# EAGLE design game_board_V2 (EAGLE 9.5.1)
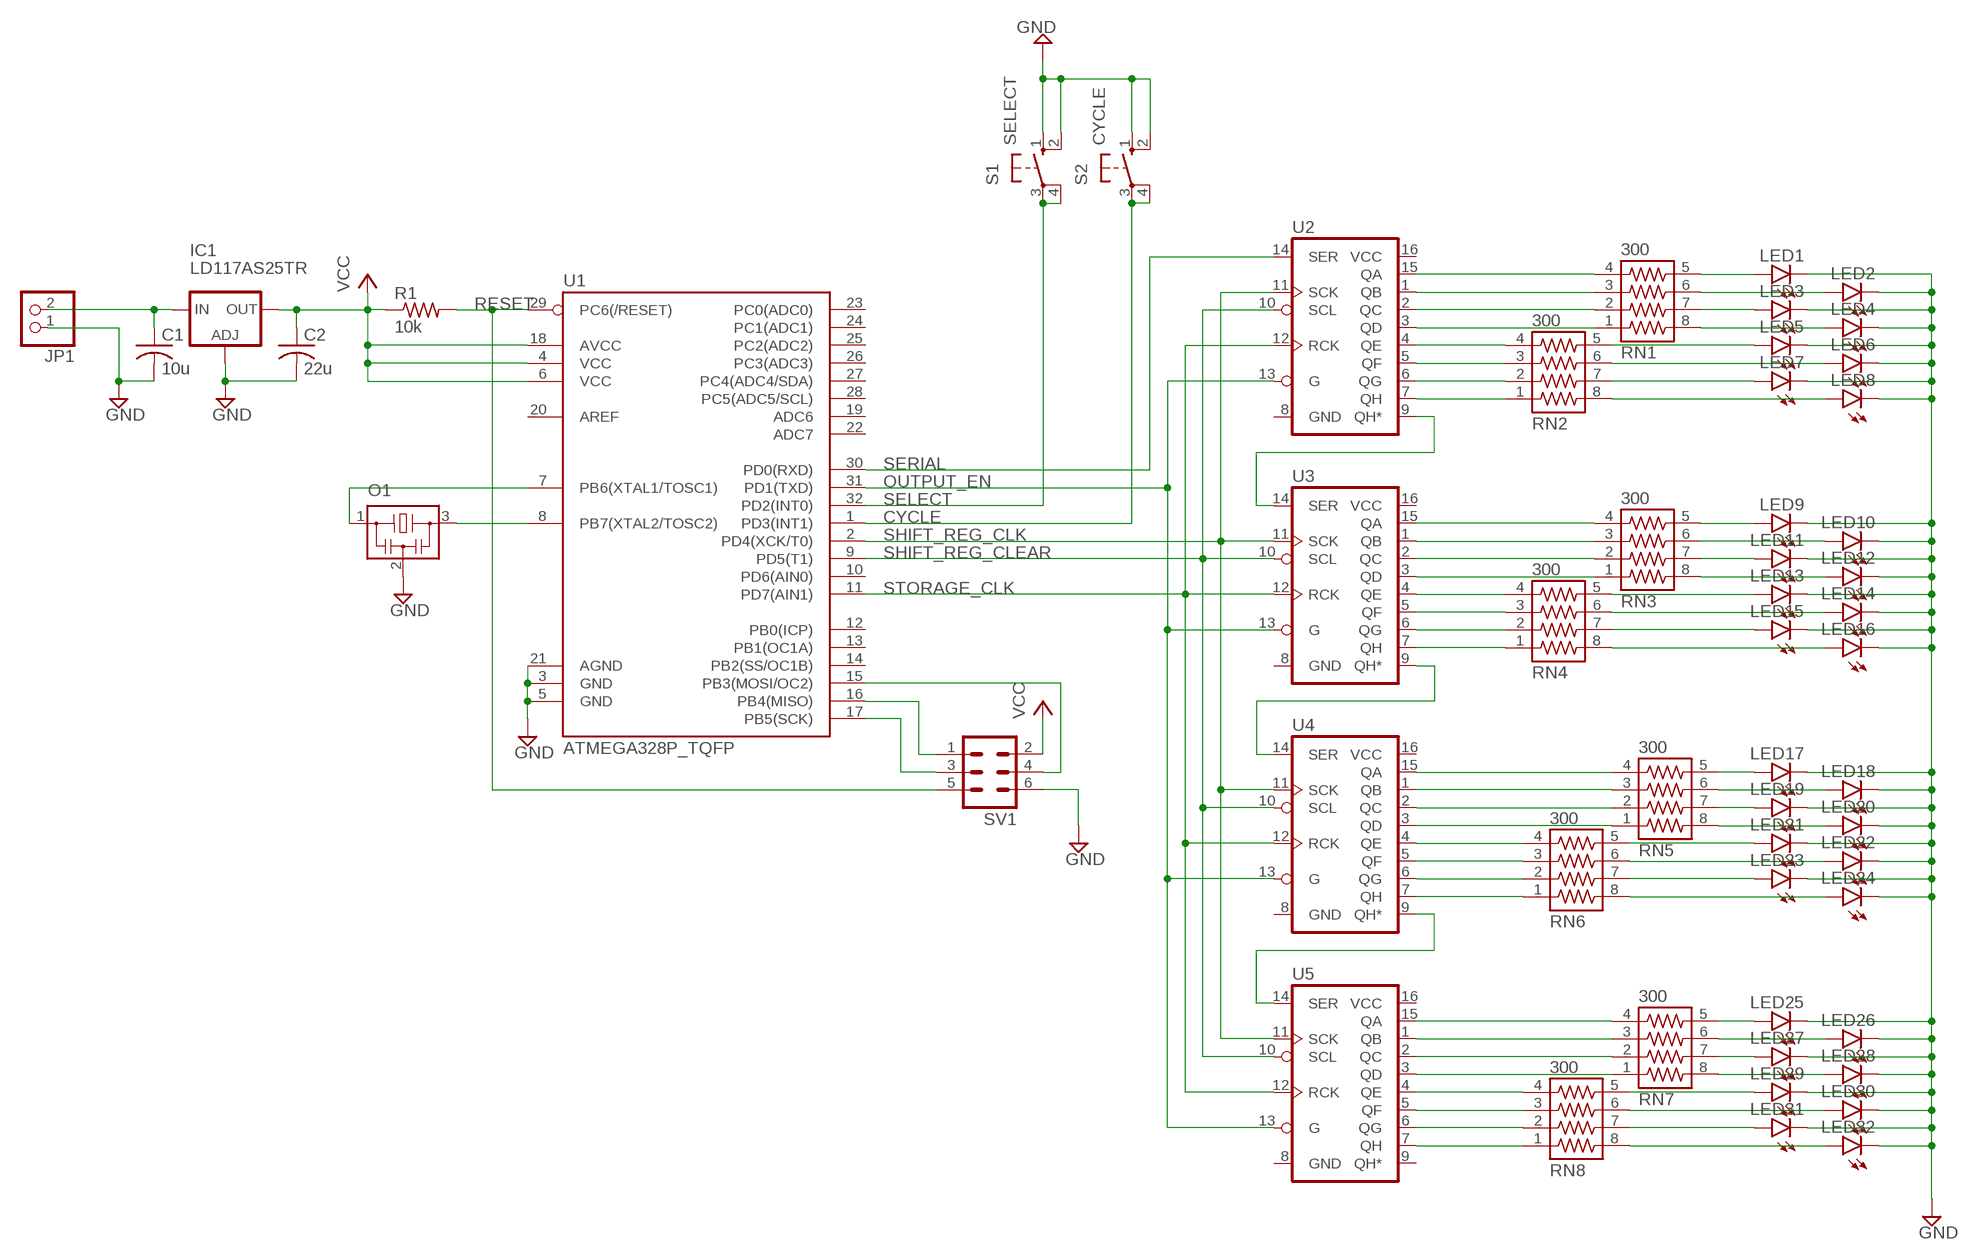
[diagram p0: schematic, sheet 1]

## Parts
C1  10u  C-USC1206K  [C1206K]
C2  22u  C-USC0805K  [C0805K]
IC1  LD117AS25TR  [SOT223]
JP1  PINHD-1X2  [1X02]
LED1  LEDSML0805  [SML0805]
LED2  LEDSML0805  [SML0805]
LED3  LEDSML0805  [SML0805]
LED4  LEDSML0805  [SML0805]
LED5  LEDSML0805  [SML0805]
LED6  LEDSML0805  [SML0805]
LED7  LEDSML0805  [SML0805]
LED8  LEDSML0805  [SML0805]
LED9  LEDSML0805  [SML0805]
LED10  LEDSML0805  [SML0805]
LED11  LEDSML0805  [SML0805]
LED12  LEDSML0805  [SML0805]
LED13  LEDSML0805  [SML0805]
LED14  LEDSML0805  [SML0805]
LED15  LEDSML0805  [SML0805]
LED16  LEDSML0805  [SML0805]
LED17  LEDSML0805  [SML0805]
LED18  LEDSML0805  [SML0805]
LED19  LEDSML0805  [SML0805]
LED20  LEDSML0805  [SML0805]
LED21  LEDSML0805  [SML0805]
LED22  LEDSML0805  [SML0805]
LED23  LEDSML0805  [SML0805]
LED24  LEDSML0805  [SML0805]
LED25  LEDSML0805  [SML0805]
LED26  LEDSML0805  [SML0805]
LED27  LEDSML0805  [SML0805]
LED28  LEDSML0805  [SML0805]
LED29  LEDSML0805  [SML0805]
LED30  LEDSML0805  [SML0805]
LED31  LEDSML0805  [SML0805]
LED32  LEDSML0805  [SML0805]
O1  CSTNE16M0V530000R0  [CSTCR6M]
R1  10k  R-US_R0603  [R0603]
RN1  300  1206_4RES_ARRAY1206  [RESCAXS80P320X250X60-8]
RN2  300  1206_4RES_ARRAY1206  [RESCAXS80P320X250X60-8]
RN3  300  1206_4RES_ARRAY1206  [RESCAXS80P320X250X60-8]
RN4  300  1206_4RES_ARRAY1206  [RESCAXS80P320X250X60-8]
RN5  300  1206_4RES_ARRAY1206  [RESCAXS80P320X250X60-8]
RN6  300  1206_4RES_ARRAY1206  [RESCAXS80P320X250X60-8]
RN7  300  1206_4RES_ARRAY1206  [RESCAXS80P320X250X60-8]
RN8  300  1206_4RES_ARRAY1206  [RESCAXS80P320X250X60-8]
S1  SELECT  10-XX  [B3F-10XX]
S2  CYCLE  10-XX  [B3F-10XX]
SV1  MA03-2  [MA03-2]
U1  ATMEGA328P_TQFP  [TQFP32-08]
U2  74595  [TSSOP16]
U3  74595  [TSSOP16]
U4  74595  [TSSOP16]
U5  74595  [TSSOP16]

## Nets
CARRY1: U2.9(QH*) U3.14(SER)
CARRY2: U3.9(QH*) U4.14(SER)
CARRY3: U4.9(QH*) U5.14(SER)
CYCLE: S2.3(P) S2.4(P1) U1.1(PD3(INT1))
GND: C1.2 C2.2 IC1.1(ADJ) JP1.1 LED1.C LED2.C LED3.C LED4.C LED5.C LED6.C LED7.C LED8.C LED9.C LED10.C LED11.C LED12.C LED13.C LED14.C LED15.C LED16.C LED17.C LED18.C LED19.C LED20.C LED21.C LED22.C LED23.C LED24.C LED25.C LED26.C LED27.C LED28.C LED29.C LED30.C LED31.C LED32.C O1.2 S1.1(S) S1.2(S1) S2.1(S) S2.2(S1) SV1.6 U1.3(GND) U1.5(GND) U1.21(AGND)
MISO: SV1.1 U1.16(PB4(MISO))
MOSI: SV1.4 U1.15(PB3(MOSI/OC2))
N$1: O1.1 U1.7(PB6(XTAL1/TOSC1))
N$2: O1.3 U1.8(PB7(XTAL2/TOSC2))
N$3: RN2.1 U2.7(QH)
N$4: RN2.2 U2.6(QG)
N$5: RN2.3 U2.5(QF)
N$6: RN2.4 U2.4(QE)
N$10: RN1.1 U2.3(QD)
N$11: RN1.2 U2.2(QC)
N$12: RN1.3 U2.1(QB)
N$13: RN1.4 U2.15(QA)
N$14: LED1.A RN1.5
N$15: LED2.A RN1.6
N$16: LED3.A RN1.7
N$17: LED4.A RN1.8
N$18: LED5.A RN2.5
N$19: LED6.A RN2.6
N$20: LED7.A RN2.7
N$21: LED8.A RN2.8
N$22: RN5.4 U4.15(QA)
N$23: RN5.3 U4.1(QB)
N$24: RN5.2 U4.2(QC)
N$25: RN5.1 U4.3(QD)
N$26: RN6.4 U4.4(QE)
N$27: RN6.3 U4.5(QF)
N$28: RN6.2 U4.6(QG)
N$29: RN6.1 U4.7(QH)
N$30: LED24.A RN6.8
N$31: LED23.A RN6.7
N$32: LED22.A RN6.6
N$33: LED21.A RN6.5
N$34: LED20.A RN5.8
N$35: LED19.A RN5.7
N$36: LED18.A RN5.6
N$37: LED17.A RN5.5
N$38: RN4.1 U3.7(QH)
N$39: RN4.2 U3.6(QG)
N$40: RN4.3 U3.5(QF)
N$41: RN4.4 U3.4(QE)
N$42: RN3.1 U3.3(QD)
N$43: RN3.2 U3.2(QC)
N$44: RN3.3 U3.1(QB)
N$45: RN3.4 U3.15(QA)
N$46: LED13.A RN4.5
N$47: LED14.A RN4.6
N$48: LED15.A RN4.7
N$49: LED16.A RN4.8
N$50: LED12.A RN3.8
N$51: LED11.A RN3.7
N$52: LED10.A RN3.6
N$53: LED9.A RN3.5
N$54: RN7.4 U5.15(QA)
N$55: RN7.3 U5.1(QB)
N$56: RN7.2 U5.2(QC)
N$57: RN7.1 U5.3(QD)
N$58: RN8.4 U5.4(QE)
N$59: RN8.3 U5.5(QF)
N$60: RN8.2 U5.6(QG)
N$61: RN8.1 U5.7(QH)
N$62: LED32.A RN8.8
N$63: LED31.A RN8.7
N$64: LED30.A RN8.6
N$65: LED29.A RN8.5
N$66: LED28.A RN7.8
N$67: LED27.A RN7.7
N$68: LED26.A RN7.6
N$69: LED25.A RN7.5
OUTPUT_EN: U1.31(PD1(TXD)) U2.13(G) U3.13(G) U4.13(G) U5.13(G)
RESET: R1.2 SV1.5 U1.29(PC6(/RESET))
SCK: SV1.3 U1.17(PB5(SCK))
SELECT: S1.3(P) S1.4(P1) U1.32(PD2(INT0))
SERIAL: U1.30(PD0(RXD)) U2.14(SER)
SHIFT_REG_CLEAR: U1.9(PD5(T1)) U2.10(SCL) U3.10(SCL) U4.10(SCL) U5.10(SCL)
SHIFT_REG_CLK: U1.2(PD4(XCK/T0)) U2.11(SCK) U3.11(SCK) U4.11(SCK) U5.11(SCK)
STORAGE_CLK: U1.11(PD7(AIN1)) U2.12(RCK) U3.12(RCK) U4.12(RCK) U5.12(RCK)
V_IN: C1.1 IC1.3(IN) JP1.2
VCC: C2.1 IC1.4(OUT) R1.1 SV1.2 U1.4(VCC) U1.6(VCC) U1.18(AVCC)
Unconnected: U1.10(PD6(AIN0)) U1.12(PB0(ICP)) U1.13(PB1(OC1A)) U1.14(PB2(SS/OC1B)) U1.19(ADC6) U1.20(AREF) U1.22(ADC7) U1.23(PC0(ADC0)) U1.24(PC1(ADC1)) U1.25(PC2(ADC2)) U1.26(PC3(ADC3)) U1.27(PC4(ADC4/SDA)) U1.28(PC5(ADC5/SCL)) U5.9(QH*)

## Power pins joined to a net without a drawn wire
GND: U2.8(GND) U3.8(GND) U4.8(GND) U5.8(GND)
VCC: U2.16(VCC) U3.16(VCC) U4.16(VCC) U5.16(VCC)

## Library data of the parts
C1 C2 = rcl:C-US: CAPACITOR, American symbol; SPICEPREFIX: C
IC1 = v-reg:LD117A?*: Low drop fixed and adjustable positive voltage regulators 1 A Source: http://www.st.com/stonline/products/literature/ds/7194/ld1117axx.pdf
JP1 = pinhead:PINHD-1X2: PIN HEADER
LED1-LED32 = led:LED: LED OSRAM: - CHIPLED LG R971, LG N971, LY N971, LG Q971, LY Q971, LO R971, LY R971 LH N974, LH R974 LS Q976, LO Q976, LY Q976 LO Q996 - Hyper CHIPLED LW Q18S LB Q993, LB Q99A, LB R99A - SideLED LS A670, LO A670, LY A670, LG A670, LP A670 LB A673, LV A673, LT A673, LW A673 LH A674 LY A675 LS A676, LA A676, LO A676, LY A676, LW A676 LS A679, LY A679, LG A679 - Hyper Micro SIDELED® LS Y876, LA Y876, LO Y876, LY Y876 LT Y87S - SmartLED LW L88C, LW L88S LB L89C, LB L89S, LG L890 LS L89K, LO L89K, LY L89K LS L896, LA L896, LO L896, LY L896 - TOPLED LS T670, LO T670, LY T670, LG T670, LP T670 LSG T670, LSP T670, LSY T670, LOP T670, LYG T670 LG T671, LOG T671, LSG T671 LB T673, LV T673, LT T673, LW T673 LH T674 LS T676, LA T676, LO T676, LY T676, LB T676, LH T676, LSB T676, LW T676 LB T67C, LV T67C, LT T67C, LS T67K, LO T67K, LY T67K, LW E67C LS E67B, LA E67B, LO E67B, LY E67B, LB E67C, LV E67C, LT E67C LW T67C LS T679, LY T679, LG T679 LS T770, LO T770, LY T770, LG T770, LP T770 LB T773, LV T773, LT T773, LW T773 LH T774 LS E675, LA E675, LY E675, LS T675 LS T776, LA T776, LO T776, LY T776, LB T776 LHGB T686 LT T68C, LB T68C - Hyper Mini TOPLED® LB M676 - Mini TOPLED Santana® LG M470 LS M47K, LO M47K, LY M47K Source: http://www.osram.convergy.de LUXEON: - LUMILED® LXK2-PW12-R00, LXK2-PW12-S00, LXK2-PW14-U00, LXK2-PW14-V00 LXK2-PM12-R00, LXK2-PM12-S00, LXK2-PM14-U00 LXK2-PE12-Q00, LXK2-PE12-R00, LXK2-PE12-S00, LXK2-PE14-T00, LXK2-PE14-U00 LXK2-PB12-K00, LXK2-PB12-L00, LXK2-PB12-M00, LXK2-PB14-N00, LXK2-PB14-P00, LXK2-PB14-Q00 LXK2-PR12-L00, LXK2-PR12-M00, LXK2-PR14-Q00, LXK2-PR14-R00 LXK2-PD12-Q00, LXK2-PD12-R00, LXK2-PD12-S00 LXK2-PH12-R00, LXK2-PH12-S00 LXK2-PL12-P00, LXK2-PL12-Q00, LXK2-PL12-R00 Source: www.luxeon.com KINGBRIGHT: KA-3528ASYC Source: www.kingbright.com
O1 = murata-resonators:CSTNE16M0V530000R0
R1 = resistor:R-US_: RESISTOR, American symbol
RN1-RN8 = res4array1206:1206_4RES_ARRAY
S1 S2 = switch-omron:10-XX: OMRON SWITCH; MPN: B3F-1000; OC_FARNELL: 176432; OC_NEWARK: 36M3542
SV1 = con-lstb:MA03-2: PIN HEADER; OC_FARNELL: unknown; OC_NEWARK: unknown
U1 = SparkFun-IC-Microcontroller:ATMEGA328P_TQFP: Popular 328P in QFP Storefront component: ATmega328 - TQFP <https://www.sparkfun.com/products/13448> (COM-13448) Datasheet <http://www.sparkfun.com/datasheets/Components/SMD/ATMega328.pdf> SparkFun Products SparkFun RedBoard - Programmed with Arduino <https://www.sparkfun.com/products/12757> (DEV-12757) Arduino Pro Mini 328 - 5V/16MHz <https://www.sparkfun.com/products/11113> (DEV-11113) Arduino Pro Mini 328 - 3.3V/8MHz <https://www.sparkfun.com/products/11114> (DEV-11114) SparkFun OpenLog <https://www.sparkfun.com/products/13712> (DEV-13712) SparkFun MicroView - OLED Arduino Module <https://www.sparkfun.com/products/12923> (DEV-12923) SparkFun Digital Sandbox <https://www.sparkfun.com/products/12651> (DEV-12651) SparkFun PicoBoard <https://www.sparkfun.com/products/11888> (WIG-11888) Arduino Fio <https://www.sparkfun.com/products/10116> (DEV-10116) LilyPad Arduino 328 Main Board <https://www.sparkfun.com/products/13342> (DEV-13342) SparkFun RedStick <https://www.sparkfun.com/products/13741> (DEV-13741) LilyPad MP3 <https://www.sparkfun.com/products/11013> (DEV-11013) LilyPad Arduino SimpleSnap <https://www.sparkfun.com/products/10941> (DEV-10941) SparkFun Stepoko <https://www.sparkfun.com/products/13899> (ROB-13899) SparkFun Geiger Counter <https://www.sparkfun.com/products/11345> (SEN-11345) SparkFun EL Sequencer <https://www.sparkfun.com/products/12781> (COM-12781) Arduino Pro 328 - 5V/16MHz <https://www.sparkfun.com/products/10915> (DEV-10915) CryptoCape <https://www.sparkfun.com/products/12773> (DEV-12773) SparkFun IR Thermometer Evaluation Board - MLX90614 <https://www.sparkfun.com/products/10740> (SEN-10740) SparkFun RedBot Mainboard <https://www.sparkfun.com/products/12097> (ROB-12097) Arduino Pro 328 - 3.3V/8MHz <https://www.sparkfun.com/products/10914> (DEV-10914) SparkFun Block for Intel® Edison - Arduino <https://www.sparkfun.com/products/13036> (DEV-13036) SparkFun Simon Says - Surface Mount Soldering Kit <https://www.sparkfun.com/products/10935> (KIT-10935) SparkFun 7-Segment Serial Display - Red <https://www.sparkfun.com/products/11441> (COM-11441) SparkFun 7-Segment Serial Display - White <https://www.sparkfun.com/products/11629> (COM-11629) SparkFun 7-Segment Serial Display - Yellow <https://www.sparkfun.com/products/11443> (COM-11443) SparkFun 7-Segment Serial Display - Kelly Green <https://www.sparkfun.com/products/11440> (COM-11440) SparkFun 7-Segment Serial Display - Blue <https://www.sparkfun.com/products/11442> (COM-11442) SparkFun OpenSegment Serial Display - 20mm (Blue) <https://www.sparkfun.com/products/11647> (COM-11647) SparkFun OpenSegment Serial Display - 20mm (Green) <https://www.sparkfun.com/products/11646> (COM-11646) SparkFun OpenSegment Serial Display - 20mm (White) <https://www.sparkfun.com/products/11648> (COM-11648) SparkFun OpenSegment Serial Display - 20mm (Red) <https://www.sparkfun.com/products/11644> (COM-11644) SparkFun OpenSegment Serial Display - 20mm (Yellow) <https://www.sparkfun.com/products/11645> (COM-11645) SparkFun OpenSegment Shield <https://www.sparkfun.com/products/13190> (DEV-13190); PROD_ID: IC-09069
U2-U5 = SparkFun-IC-Logic:74*595: 8-Bit Shift Register (Serial to Parallel) Datasheet <http://cdn.sparkfun.com/datasheets/BreakoutBoards/MM74HC595.pdf> SparkFun Products SparkFun Shift Register Breakout - 74HC595 <https://www.sparkfun.com/products/10680> (BOB-10680)

## Board
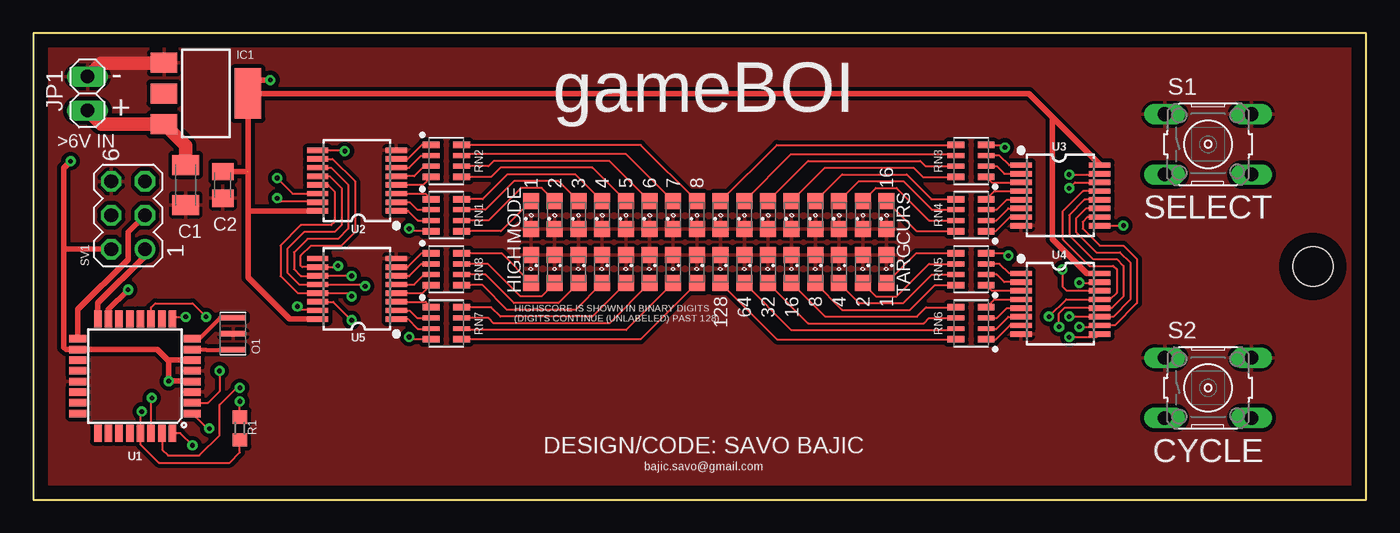
[diagram p1: board, top side]
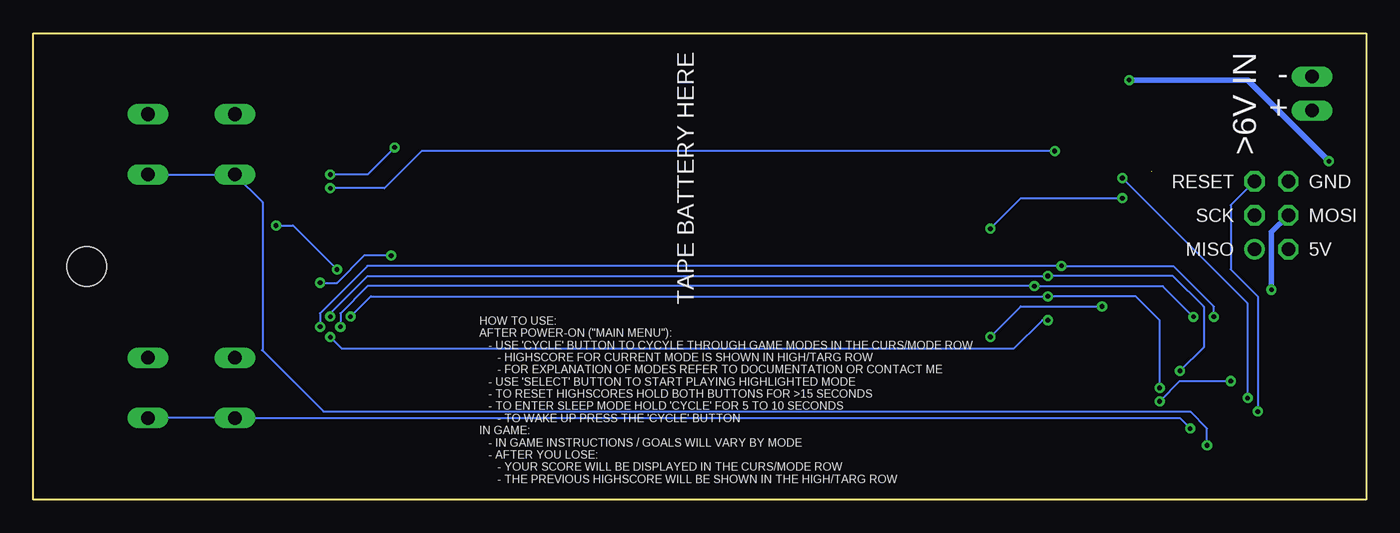
[diagram p2: board, bottom side, seen from below]

Size 100 x 35 mm. Coordinates in mm from the lower left corner, seen from the top.
Outline: 0,0 100,0 100,35 0,35 0,0
Copper layers (1*16): Top 0.035mm / dielectric 1.5mm / Bottom 0.035mm
Design rules "default": minimum track width 6mil, minimum drill 0.35mm, track to track 6mil, track to pad 6mil, pad to pad 6mil, via to via 6mil, smd to smd 6mil, copper to edge 40mil, drill to drill 6mil, minimum pad ring 10mil, minimum via ring 8mil, stop-mask expansion 4mil, vias tented up to drill 0mil, thermal gap 10mil
Holes 3 mm at 96,17.5

### Footprints (pad centres in the part's own frame; a part is rotated, then mirrored left to right if it is on the bottom)
C1206K = smd 1.5 x 2: 1 -1.5,0; 2 1.5,0
C0805K = smd 1.3 x 1.6: 1 -1,0; 2 1,0
SOT223 = smd 1.5 x 2: 1 -2.3,-3.15; 2 0,-3.15; 3 2.3,-3.15 | smd 3.8 x 2: 4 0,3.15
1X02 = drill 1.016 long: 1 -1.27,0; 2 1.27,0
SML0805 = smd 1.2 x 1.2: A 1.05,0; C -1.05,0
CSTCR6M = smd 0.4 x 1.9: 1 -1.2,0; 2 0,0; 3 1.2,0
R0603 = smd 1 x 1.1: 1 -0.85,0; 2 0.85,0
RESCAXS80P320X250X60-8 = smd 1.268 x 0.489: 1 -1.131,1.2; 4 -1.131,-1.2; 5 1.131,-1.2; 8 1.131,1.2 | smd 1.268 x 0.372: 2 -1.131,0.4; 3 -1.131,-0.4; 6 1.131,-0.4; 7 1.131,0.4
B3F-10XX = drill 1.016 long: 1 -3.251,2.261; 2 3.251,2.261; 3 -3.251,-2.261; 4 3.251,-2.261
MA03-2 = drill 1.016: 1 -2.54,-1.27 | drill 1.016 octagon: 2 -2.54,1.27; 3 0,-1.27; 4 0,1.27; 5 2.54,-1.27; 6 2.54,1.27
TQFP32-08 = smd 1.27 x 0.559: 1 -4.293,2.8; 2 -4.293,2; 3 -4.293,1.2; 4 -4.293,0.4; 5 -4.293,-0.4; 6 -4.293,-1.2; 7 -4.293,-2; 8 -4.293,-2.8; 17 4.293,-2.8; 18 4.293,-2; 19 4.293,-1.2; 20 4.293,-0.4; 21 4.293,0.4; 22 4.293,1.2; 23 4.293,2; 24 4.293,2.8 | smd 0.559 x 1.27: 9 -2.8,-4.293; 10 -2,-4.293; 11 -1.2,-4.293; 12 -0.4,-4.293; 13 0.4,-4.293; 14 1.2,-4.293; 15 2,-4.293; 16 2.8,-4.293; 25 2.8,4.293; 26 2,4.293; 27 1.2,4.293; 28 0.4,4.293; 29 -0.4,4.293; 30 -1.2,4.293; 31 -2,4.293; 32 -2.8,4.293
TSSOP16 = smd 0.4 x 1.6: 1 -2.225,-2.85; 2 -1.575,-2.85; 3 -0.925,-2.85; 4 -0.275,-2.85; 5 0.375,-2.85; 6 1.025,-2.85; 7 1.675,-2.85; 8 2.325,-2.85; 9 2.325,3.05; 10 1.675,3.05; 11 1.025,3.05; 12 0.375,3.05; 13 -0.275,3.05; 14 -0.925,3.05; 15 -1.575,3.05; 16 -2.225,3.05

### Placement (x,y rotation side)
C1  11.43,23.62 270 top
C2  14.22,23.62 270 top
IC1  12.95,30.48 270 top
JP1  4.06,30.48 270 top
LED1  37.34,21.35 90 top
LED2  39.12,21.35 90 top
LED3  40.89,21.35 90 top
LED4  42.67,21.35 90 top
LED5  44.45,21.35 90 top
LED6  46.23,21.35 90 top
LED7  48.01,21.35 90 top
LED8  49.78,21.35 90 top
LED9  51.56,21.35 90 top
LED10  53.34,21.35 90 top
LED11  55.12,21.35 90 top
LED12  56.9,21.35 90 top
LED13  58.67,21.35 90 top
LED14  60.45,21.35 90 top
LED15  62.23,21.35 90 top
LED16  64.01,21.35 90 top
LED17  64.01,17.29 270 top
LED18  62.23,17.29 270 top
LED19  60.45,17.29 270 top
LED20  58.67,17.29 270 top
LED21  56.9,17.29 270 top
LED22  55.12,17.29 270 top
LED23  53.34,17.29 270 top
LED24  51.56,17.29 270 top
LED25  49.78,17.29 270 top
LED26  48.01,17.29 270 top
LED27  46.23,17.29 270 top
LED28  44.45,17.29 270 top
LED29  42.67,17.29 270 top
LED30  40.89,17.29 270 top
LED31  39.12,17.29 270 top
LED32  37.34,17.29 270 top
O1  14.99,12.45 90 top
R1  15.49,5.33 270 top
RN1  30.99,21.35 0 top
RN2  30.99,25.42 0 top
RN3  70.36,25.42 180 top
RN4  70.36,21.35 180 top
RN5  70.36,17.29 180 top
RN6  70.36,13.22 180 top
RN7  30.99,13.22 0 top
RN8  30.99,17.29 0 top
S1  88.14,26.67 0 top
S2  88.14,8.38 0 top
SV1  7.11,21.34 90 top
U1  7.63,9.27 180 top
U2  24.38,23.89 90 top
U3  76.96,22.88 270 top
U4  76.96,14.75 270 top
U5  24.38,15.76 90 top

### Tracks (layer width: path | path; a pad name or v marks a point on that pad's centre or on a via)
CARRY1  (via drill 0.35)
  Top 0.152: U2.9 23.31,26.22 v23.37,26.16 | v77.72,23.37 78.16,23.8 U3.14
  Bottom 0.152: v23.37,26.16 70.87,26.16 73.66,23.37 v77.72,23.37
CARRY2  (via drill 0.35)
  Top 0.152: U3.9 81.77,20.55 v81.79,20.57 | v77.22,17.27 77.22,16 77.55,15.66 U4.14
  Bottom 0.152: v81.79,20.57 80.52,20.57 v77.22,17.27
CARRY3  (via drill 0.35)
  Top 0.152: U5.14 22.5,14.84 v23.88,13.46 | v77.72,12.19 79.78,12.19 U4.9
  Bottom 0.152: v23.88,13.46 24.3,13.46 26.42,11.35 76.88,11.35 v77.72,12.19
CYCLE  (via drill 0.35)
  Top 0.152: U1.1 13.06,5.33 v13.21,5.33
  Bottom 0.152: v13.21,5.33 13.99,6.12 S2.3 S2.4
GND
  Top 1.016: IC1.1 9.79,32.77 5.08,32.77 JP1.1
  pour Top (isolate 0.305): 0,35 0,0 100,0 100,35
MISO
  Top 0.406: U1.16 4.83,14.74 8.38,18.29 SV1.1
MOSI  (via drill 0.35)
  Top 0.406: U1.15 5.63,14.27 v7.11,15.75
  Bottom 0.406: v7.11,15.75 7.11,20.07 SV1.4
N$1
  Top 0.305: U1.7 12.94,11.27 12.96,11.25 O1.1
N$2
  Top 0.305: U1.8 12.44,12.07 14.02,13.65 O1.3
N$3
  Top 0.152: U2.7 28.09,25.57 29.14,26.62 RN2.1
N$4
  Top 0.152: U2.6 28.2,24.92 29.1,25.82 RN2.2
N$5
  Top 0.152: RN2.3 29.32,25.02 28.57,24.27 U2.5
N$6
  Top 0.152: RN2.4 29.26,23.62 U2.4
N$10
  Top 0.152: U2.3 29.44,22.97 RN1.1
N$11
  Top 0.152: U2.2 28.25,22.32 28.81,21.75 RN1.2
N$12
  Top 0.152: U2.1 28.13,21.67 28.85,20.95 RN1.3
N$13  (via drill 0.35)
  Top 0.152: RN1.4 28.38,20.15 v28.19,20.34 | v18.29,22.62 18.54,22.37 21.28,22.37 U2.15
  Bottom 0.152: v28.19,20.34 25.91,22.62 v18.29,22.62
N$14
  Top 0.152: LED1.A 35.09,20.15 RN1.5
N$15
  Top 0.152: LED2.A 38.13,23.38 36.58,23.38 34.14,20.95 RN1.6
N$16
  Top 0.152: LED3.A 39.4,23.89 36.07,23.89 33.93,21.75 RN1.7
N$17
  Top 0.152: LED4.A 40.67,24.4 35.56,24.4 33.71,22.55 RN1.8
N$18
  Top 0.152: LED5.A 41.94,24.91 35.05,24.91 34.36,24.22 RN2.5
N$19
  Top 0.152: LED6.A 43.21,25.42 34.54,25.42 34.14,25.02 RN2.6
N$20
  Top 0.152: LED7.A 44.48,25.92 32.23,25.92 RN2.7
N$21
  Top 0.152: LED8.A 45.57,26.62 RN2.8
N$22  (via drill 0.35)
  Top 0.152: RN5.4 72.97,18.49 v73.15,18.3 | v78.49,16.27 79.96,16.27 U4.15
  Bottom 0.152: v78.49,16.27 77.22,16.27 75.18,18.3 v73.15,18.3
N$23
  Top 0.152: U4.1 73.21,16.97 72.5,17.69 RN5.3
N$24
  Top 0.152: U4.2 72.85,16.32 72.28,16.89 RN5.2
N$25
  Top 0.152: U4.3 71.9,15.67 RN5.1
N$26
  Top 0.152: RN6.4 72.09,15.02 U4.4
N$27
  Top 0.152: RN6.3 72.28,13.62 73.03,14.37 U4.5
N$28
  Top 0.152: RN6.2 72.24,12.82 73.14,13.72 U4.6
N$29
  Top 0.152: RN6.1 72.21,12.02 73.25,13.07 U4.7
N$30
  Top 0.152: LED24.A 55.78,12.02 RN6.8
N$31
  Top 0.152: LED23.A 56.86,12.72 69.12,12.72 RN6.7
N$32
  Top 0.152: LED22.A 58.13,13.22 66.8,13.22 67.2,13.62 RN6.6
N$33
  Top 0.152: LED21.A 59.4,13.73 66.29,13.73 66.99,14.42 RN6.5
N$34
  Top 0.152: LED20.A 60.67,14.24 65.79,14.24 67.63,16.09 RN5.8
N$35
  Top 0.152: LED19.A 61.94,14.75 65.28,14.75 67.42,16.89 RN5.7
N$36
  Top 0.152: LED18.A 63.21,15.26 64.77,15.26 67.2,17.69 RN5.6
N$37
  Top 0.152: LED17.A 66.26,18.49 RN5.5
N$38
  Top 0.152: RN4.1 72.21,20.15 73.25,21.2 U3.7
N$39
  Top 0.152: RN4.2 72.24,20.95 73.14,21.85 U3.6
N$40
  Top 0.152: RN4.3 72.28,21.75 73.03,22.5 U3.5
N$41
  Top 0.152: RN4.4 72.09,23.15 U3.4
N$42
  Top 0.152: RN3.1 71.9,23.8 U3.3
N$43
  Top 0.152: RN3.2 72.28,25.02 72.85,24.45 U3.2
N$44
  Top 0.152: U3.1 73.21,25.1 72.5,25.82 RN3.3
N$45  (via drill 0.35)
  Top 0.152: RN3.4 72.71,26.62 v72.9,26.43 | v77.72,24.4 79.96,24.4 U3.15
  Bottom 0.152: v72.9,26.43 74.93,24.4 v77.72,24.4
N$46
  Top 0.152: LED13.A 60.67,24.4 65.53,24.4 67.38,22.55 RN4.5
N$47
  Top 0.152: LED14.A 61.94,23.89 65.28,23.89 67.42,21.75 RN4.6
N$48
  Top 0.152: LED15.A 63.21,23.38 64.77,23.38 67.2,20.95 RN4.7
N$49
  Top 0.152: LED16.A 66.26,20.15 RN4.8
N$50
  Top 0.152: LED12.A 59.4,24.91 66.04,24.91 66.73,24.22 RN3.8
N$51
  Top 0.152: LED11.A 58.13,25.42 66.55,25.42 66.95,25.02 RN3.7
N$52
  Top 0.152: LED10.A 56.86,25.92 69.12,25.92 RN3.6
N$53
  Top 0.152: LED9.A 55.78,26.62 RN3.5
N$54  (via drill 0.35)
  Top 0.152: RN7.4 28.38,12.02 v28.19,12.21 | v19.81,14.49 20.07,14.24 21.28,14.24 U5.15
  Bottom 0.152: v28.19,12.21 25.91,14.49 v19.81,14.49
N$55
  Top 0.152: U5.1 28.13,13.54 28.85,12.82 RN7.3
N$56
  Top 0.152: U5.2 28.25,14.19 28.81,13.62 RN7.2
N$57
  Top 0.152: U5.3 29.44,14.84 RN7.1
N$58
  Top 0.152: U5.4 29.19,15.49 29.79,16.09 RN8.4
N$59
  Top 0.152: U5.5 28.57,16.14 29.32,16.89 RN8.3
N$60
  Top 0.152: U5.6 28.18,16.79 28.19,16.78 29.1,17.69 RN8.2
N$61
  Top 0.152: U5.7 28.09,17.44 29.14,18.49 RN8.1
N$62
  Top 0.152: RN8.8 35.12,18.49 37.34,16.27 LED32.A
N$63
  Top 0.152: LED31.A 38.13,15.26 36.54,15.26 34.11,17.69 RN8.7
N$64
  Top 0.152: LED30.A 39.4,14.75 36.07,14.75 33.93,16.89 RN8.6
N$65
  Top 0.152: LED29.A 40.67,14.24 35.56,14.24 33.71,16.09 RN8.5
N$66
  Top 0.152: LED28.A 41.94,13.73 35.05,13.73 34.36,14.42 RN7.8
N$67
  Top 0.152: LED27.A 43.21,13.22 34.54,13.22 34.14,13.62 RN7.7
N$68
  Top 0.152: LED26.A 44.48,12.72 32.23,12.72 RN7.6
N$69
  Top 0.152: LED25.A 45.57,12.02 RN7.5
OUTPUT_EN  (via drill 0.35)
  Top 0.152: U3.13 78.76,23.15 77.22,21.61 77.22,19.57 79.25,17.54 81.03,17.54 81.28,17.29 81.28,15.51 80.77,15 80.75,15.02 U4.13 77.5,15.02 v76.2,13.73 | U2.13 22.12,23.62 22.61,23.13 22.61,20.84 22.35,20.59 20.07,20.59 18.54,19.07 18.54,16.78 19.83,15.49 U5.13 23.64,15.49 v23.88,15.26 | U1.31 9.67,4.93 9.67,3.74 10.11,3.3 12.45,3.3 13.97,4.83 13.97,7.11 15.24,8.38 v15.49,8.38
  Bottom 0.152: v76.2,13.73 74.68,15.26 v23.88,15.26 17.29,15.26 15.49,13.46 v15.49,8.38
RESET  (via drill 0.35)
  Top 0.152: R1.2 15.49,3.53 14.73,2.77 9.42,2.77 8.03,4.16 U1.29 8.03,6.51
  Top 0.254: v8.13,6.6 8.03,6.51
  Bottom 0.152: SV1.5 10.16,22.1 10.16,17.27 8.13,15.24 v8.13,6.6
SCK
  Top 0.406: U1.17 3.34,14.26 7.11,18.03 7.11,20.07 SV1.3
SELECT  (via drill 0.35)
  Top 0.152: U1.32 11.03,4.97 v11.94,4.06
  Bottom 0.152: v11.94,4.06 11.94,5.33 13.21,6.6 78.23,6.6 82.8,11.18 | S1.4 S1.3 82.8,22.33 82.8,11.18 | 82.84,11.21 82.8,11.18
SERIAL  (via drill 0.35)
  Top 0.152: U1.30 8.83,7.56 v8.89,7.62 | v18.29,24.13 19.45,22.97 U2.14
  Bottom 0.152: v8.89,7.62 8.89,14.73 v18.29,24.13
SHIFT_REG_CLEAR  (via drill 0.35)
  Top 0.152: U3.10 79.1,21.2 78.74,20.84 78.74,20.34 80.01,19.07 81.79,19.07 82.8,18.05 82.8,14.75 81.13,13.07 U4.10 79.91,12.97 v78.49,12.97 | U2.10 22.45,25.57 24.13,23.89 24.13,20.08 23.11,19.07 20.83,19.07 20.07,18.3 20.07,17.54 20.17,17.44 U5.10 22.76,17.44 v22.86,17.54 | U1.9 10.59,13.72 v11.43,13.72
  Bottom 0.152: v78.49,12.97 78.49,13.99 74.93,17.54 v22.86,17.54 22.84,17.53 14.48,17.53 11.43,14.48 v11.43,13.72
SHIFT_REG_CLK  (via drill 0.35)
  Top 0.152: U3.11 78.98,21.85 78.23,21.1 78.23,20.08 79.76,18.56 81.53,18.56 82.3,17.8 82.3,15 81.02,13.72 U4.11 77.73,13.72 v77.72,13.73 | U2.11 22.34,24.92 23.62,23.64 23.62,20.34 22.86,19.57 20.57,19.57 19.56,18.56 19.56,17.29 20.06,16.79 U5.11 21.34,16.78 v23.88,16.78 | v13.97,9.65 13.97,8.13 13.11,7.27 U1.2
  Bottom 0.152: v77.72,13.73 77.72,13.99 74.93,16.78 v23.88,16.78 14.49,16.78 12.19,14.48 12.19,11.43 v13.97,9.65
STORAGE_CLK  (via drill 0.35)
  Top 0.152: U3.12 78.87,22.5 77.72,21.35 77.72,19.83 79.5,18.05 81.28,18.05 81.79,17.54 81.79,15.26 80.91,14.37 U4.12 77.35,14.37 76.96,13.99 v76.96,12.97 | U2.12 22.23,24.27 23.11,23.38 23.11,20.59 22.61,20.08 20.32,20.08 19.05,18.81 19.05,17.03 19.95,16.14 U5.12 24.77,16.14 v24.89,16.02 | U1.11 8.83,14.42 9.14,14.73 11.94,14.73 v12.95,13.72
  Bottom 0.152: v76.96,12.97 76.96,13.99 74.93,16.02 v24.89,16.02 24.88,16 15.24,16 v12.95,13.72
V_IN
  Top 1.016: JP1.2 5.09,28.18 IC1.3 11.43,26.55 C1.1
VCC  (via drill 0.35)  (1 unrouted)
  Top 0.152: R1.1 v15.49,7.37
  Top 0.305: 11.9,8.89 U1.4 | 10.21,10.47 10.16,10.41
  Top 0.406: 11.9,8.89 v10.16,8.89 10.16,10.41 9.31,11.27 U1.18 2.45,11.27 2.29,11.43 2.29,18.8 | U1.6 10.21,10.47 | 2.29,18.8 SV1.2 | v2.79,25.4 2.29,24.89 2.29,18.8 | v17.78,31.5 16.61,31.5 16.1,30.99 IC1.4 | U4.16 79.04,16.97 76.45,19.56 76.45,28.7 | 76.45,28.7 80.01,25.14 U3.16 | IC1.4 74.68,30.48 76.45,28.7 | U5.16 19.23,13.54 16.1,16.66 16.1,21.59 | 16.1,21.59 16.1,24.63 | IC1.4 16.1,24.64 16.09,24.62 15.24,24.62 C2.1 | U2.16 16.18,21.67 16.1,21.59
  Bottom 0.152: v15.49,7.37 13.97,8.89 v10.16,8.89
  Bottom 0.406: v2.79,25.4 8.89,31.5 v17.78,31.5

### Text on the board
tNames: - | gameBOI | + | >6V IN | 1 | 2 | 3 | 4 | 5 | 6 | 7 | 8 | 16 | SELECT | MODE | CURS | HIGH | TARG | 128 | 64 | 32 | 16 | 8 | 4 | 2 | 1 | HIGHSCORE IS SHOWN IN BINARY DIGITS / (DIGITS CONTINUE (UNLABELED) PAST 128) | CYCLE | DESIGN/CODE: SAVO BAJIC | bajic.savo@gmail.com
bNames: - | >6V IN | + | GND | RESET | TAPE BATTERY HERE | MOSI | SCK | 5V | MISO | HOW TO USE: / AFTER POWER-ON ("MAIN MENU"): / - USE 'CYCLE' BUTTON TO CYCYLE THROUGH GAME MODES IN THE CURS/MODE ROW / - HIGHSCORE FOR CURRENT MODE IS SHOWN IN HIGH/TARG ROW / - FOR EXPLANATION OF MODES REFER TO DOCUMENTATION OR CONTACT ME / - USE 'SELECT' BUTTON TO START PLAYING HIGHLIGHTED MODE / - TO RESET HIGHSCORES HOLD BOTH BUTTONS FOR >15 SECONDS / - TO ENTER SLEEP MODE HOLD 'CYCLE' FOR 5 TO 10 SECONDS / - TO WAKE UP PRESS THE 'CYCLE' BUTTON / IN GAME: / - IN GAME INSTRUCTIONS / GOALS WILL VARY BY MODE / - AFTER YOU LOSE: / - YOUR SCORE WILL BE DISPLAYED IN THE CURS/MODE ROW / - THE PREVIOUS HIGHSCORE WILL BE SHOWN IN THE HIGH/TARG ROW